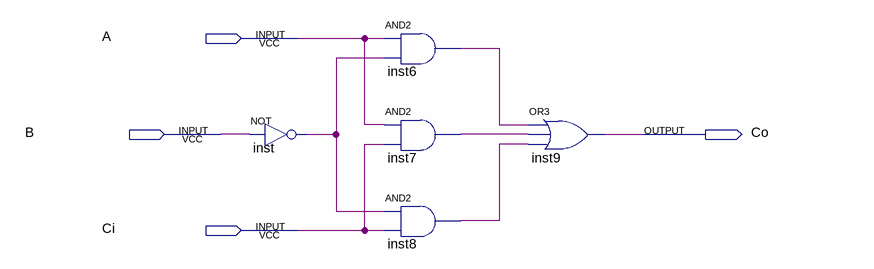
[diagram p0: schematic sheet]
// Quartus schematic maiorQue_Bit.bdf as structural Verilog: 5 symbols, 4 pins
module maiorQue_Bit (
  input  A,
  input  B,
  input  Ci,
  output Co
);

  wire inst6_out, inst7_out, inst8_out, inst_out;

  not inst (inst_out, B);
  and inst6 (inst6_out, A, inst_out);
  and inst7 (inst7_out, A, Ci);
  and inst8 (inst8_out, inst_out, Ci);
  or inst9 (Co, inst6_out, inst7_out, inst8_out);
endmodule
